# Altium schematic sheet Force.SchDoc: Force
size A4; Author: João Guimarães; Revision: 2.0
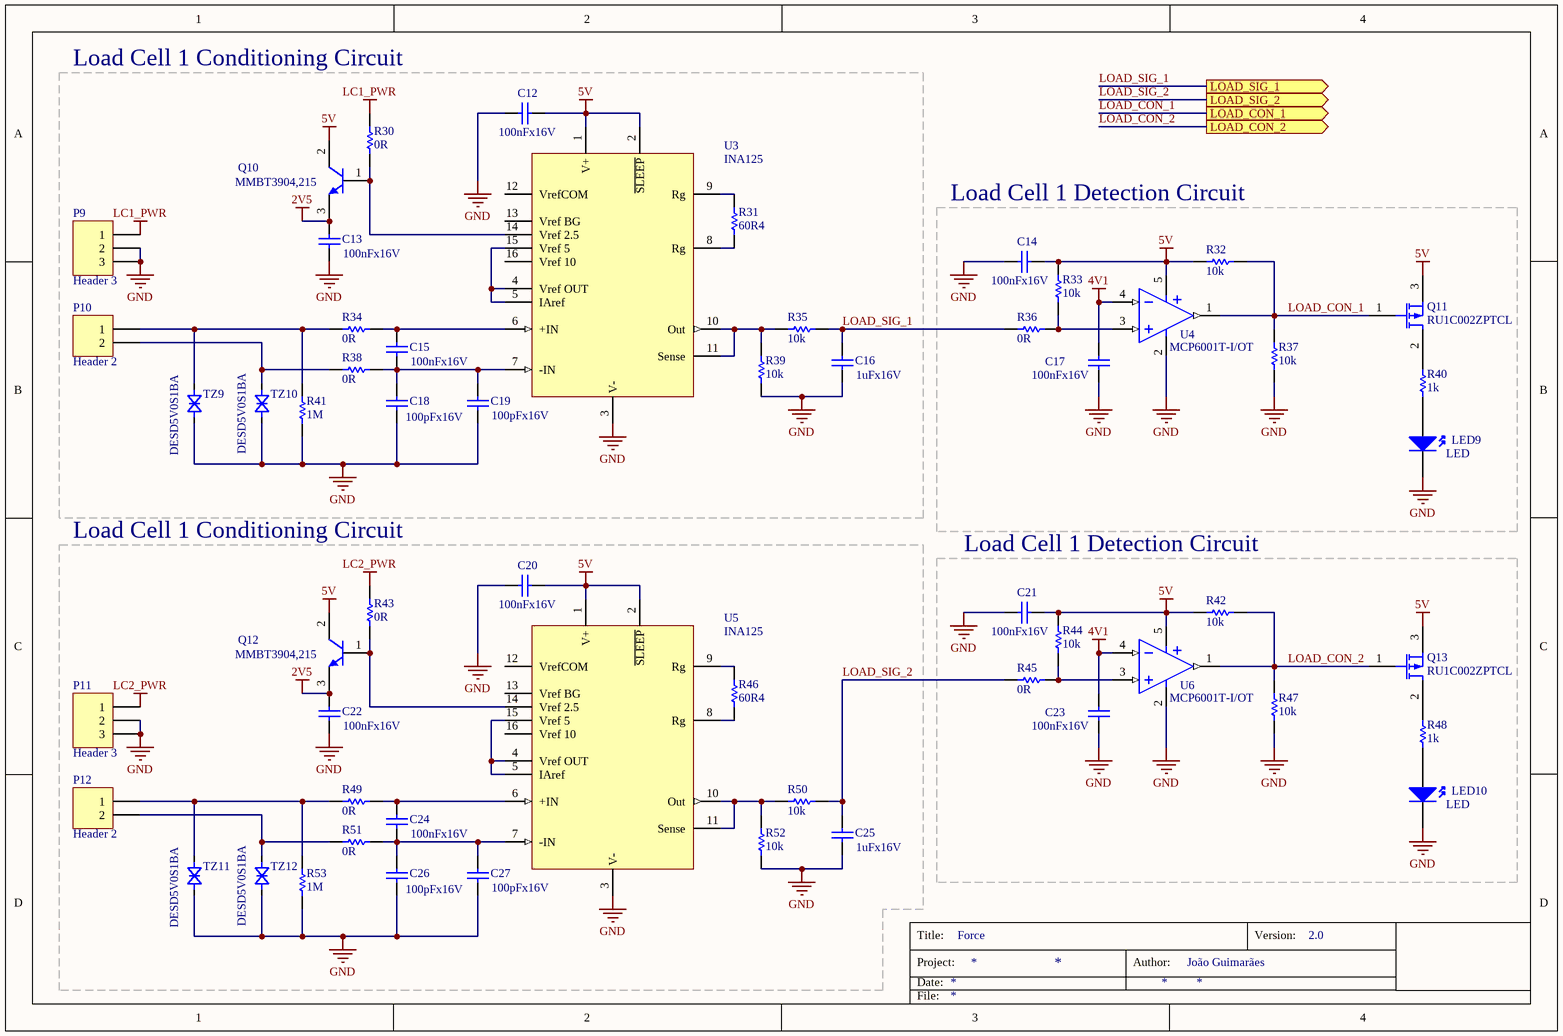
[diagram p0: Force.SchDoc]

## Parts
C12  100nFx16V  [DISC-0805]
C13  100nFx16V  [DISC-0805]
C14  100nFx16V  [DISC-0805]
C15  100nFx16V  [DISC-0805]
C16  1uFx16V  [DISC-0805]
C17  100nFx16V  [DISC-0805]
C18  100pFx16V  [DISC-0805]
C19  100pFx16V  [DISC-0805]
C20  100nFx16V  [DISC-0805]
C21  100nFx16V  [DISC-0805]
C22  100nFx16V  [DISC-0805]
C23  100nFx16V  [DISC-0805]
C24  100nFx16V  [DISC-0805]
C25  1uFx16V  [DISC-0805]
C26  100pFx16V  [DISC-0805]
C27  100pFx16V  [DISC-0805]
LED9  LED  [DISC-LED-0.1-PTH]
LED10  LED  [DISC-LED-0.1-PTH]
P9  Header 3  [CON-FLEXWIRE-0.5MM2-1X3]
P10  Header 2  [CON-BORNE-2]
P11  Header 3  [CON-FLEXWIRE-0.5MM2-1X3]
P12  Header 2  [CON-BORNE-2]
Q10  MMBT3904,215  [DISC-SOT-23]
Q11  RU1C002ZPTCL  [DISC-SOT-23]
Q12  MMBT3904,215  [DISC-SOT-23]
Q13  RU1C002ZPTCL  [DISC-SOT-23]
R30  0R  [DISC-0805]
R31  60R4  [DISC-0805]
R32  10k  [DISC-0805]
R33  10k  [DISC-0805]
R34  0R  [DISC-0805]
R35  10k  [DISC-0805]
R36  0R  [DISC-0805]
R37  10k  [DISC-0805]
R38  0R  [DISC-0805]
R39  10k  [DISC-0805]
R40  1k  [DISC-0805]
R41  1M  [DISC-0805]
R42  10k  [DISC-0805]
R43  0R  [DISC-0805]
R44  10k  [DISC-0805]
R45  0R  [DISC-0805]
R46  60R4  [DISC-0805]
R47  10k  [DISC-0805]
R48  1k  [DISC-0805]
R49  0R  [DISC-0805]
R50  10k  [DISC-0805]
R51  0R  [DISC-0805]
R52  10k  [DISC-0805]
R53  1M  [DISC-0805]
TZ9  DESD5V0S1BA  [DISC-SOD-323]
TZ10  DESD5V0S1BA  [DISC-SOD-323]
TZ11  DESD5V0S1BA  [DISC-SOD-323]
TZ12  DESD5V0S1BA  [DISC-SOD-323]
U3  INA125  [CI-SOIC-16]
U4  MCP6001T-I/OT  [CI-SOT-23-5]
U5  INA125  [CI-SOIC-16]
U6  MCP6001T-I/OT  [CI-SOT-23-5]

## Blocks framed on the sheet
Load Cell 1 Conditioning Circuit: C12 C13 C15 C16 C18 C19 P9 P10 Q10 R30 R31 R34 R35 R38 R39 R41 TZ9 TZ10 U3
Load Cell 1 Detection Circuit: C14 C17 LED9 Q11 R32 R33 R36 R37 R40 U4
Load Cell 1 Conditioning Circuit: C20 C22 C24-C27 P11 P12 Q12 R43 R46 R49-R53 TZ11 TZ12 U5
Load Cell 1 Detection Circuit: C21 C23 LED10 Q13 R42 R44 R45 R47 R48 U6

## Ports
LOAD_CON_1 (out), LOAD_CON_2 (out), LOAD_SIG_1 (out), LOAD_SIG_2 (out)

## Nets
2V5: C13.2 C22.2 Q10.3(E) Q12.3(E)
4V1: C17.2 C23.2 U4.4(IN-) U6.4(IN-)
5V: C12.1 C14.2 C20.1 C21.2 Q10.2(C) Q11.3(S) Q12.2(C) Q13.3(S) R32.1 R33.1 R42.1 R44.1 U3.1(V+) U3.2(~{SLEEP}) U4.5(V+) U5.1(V+) U5.2(~{SLEEP}) U6.5(V+)
GND: C12.2 C13.1 C14.1 C16.1 C17.1 C18.1 C19.1 C20.2 C21.1 C22.1 C23.1 C25.1 C26.1 C27.1 LED9.2(K) LED10.2(K) P9.2 P9.3 P11.2 P11.3 R37.2 R39.2 R41.1 R47.2 R52.2 R53.1 TZ9.1(A) TZ10.1(A) TZ11.1(A) TZ12.1(A) U3.3(V-) U4.2(V-) U5.3(V-) U6.2(V-)
LC1_PWR: P9.1 R30.1
LC2_PWR: P11.1 R43.1
LOAD_CON_1: Q11.1(G) R32.2 R37.1 U4.1(Out) ; port LOAD_CON_1
LOAD_CON_2: Q13.1(G) R42.2 R47.1 U6.1(Out) ; port LOAD_CON_2
LOAD_SIG_1: C16.2 R35.2 R36.1 ; port LOAD_SIG_1
LOAD_SIG_2: C25.2 R45.1 R50.2 ; port LOAD_SIG_2
NetC15_1: C15.1 C18.2 C19.2 R38.1 U3.7(-IN)
NetC15_2: C15.2 R34.1 U3.6(+IN)
NetC24_1: C24.1 C26.2 C27.2 R51.1 U5.7(-IN)
NetC24_2: C24.2 R49.1 U5.6(+IN)
NetLED9_1: LED9.1(A) R40.1
NetLED10_1: LED10.1(A) R48.1
NetP10_1: P10.1 R34.2 R41.2 TZ9.2(K)
NetP10_2: P10.2 R38.2 TZ10.2(K)
NetP12_1: P12.1 R49.2 R53.2 TZ11.2(K)
NetP12_2: P12.2 R51.2 TZ12.2(K)
NetQ10_1: Q10.1(B) R30.2 U3.14(Vref_2.5)
NetQ11_2: Q11.2(D) R40.2
NetQ12_1: Q12.1(B) R43.2 U5.14(Vref_2.5)
NetQ13_2: Q13.2(D) R48.2
NetR31_1: R31.1 U3.9(Rg)
NetR31_2: R31.2 U3.8(Rg)
NetR33_2: R33.2 R36.2 U4.3(IN+)
NetR35_1: R35.1 R39.1 U3.10(Out) U3.11(Sense)
NetR44_2: R44.2 R45.2 U6.3(IN+)
NetR46_1: R46.1 U5.9(Rg)
NetR46_2: R46.2 U5.8(Rg)
NetR50_1: R50.1 R52.1 U5.10(Out) U5.11(Sense)
NetU3_4: U3.4(Vref_OUT) U3.5(IAref) U3.15(Vref_5)
NetU5_4: U5.4(Vref_OUT) U5.5(IAref) U5.15(Vref_5)

Not connected (* = marked no-connect by the designer): U3 12(VrefCOM) 13(Vref_BG) 16(Vref_10); U5 12(VrefCOM) 13(Vref_BG) 16(Vref_10)

## Notes on the sheet
- Title:
- Project:
- Date:
- Author:
- Version:
- File:

## Library data of the parts
C12-C27 = Cap: Capacitor
P9 P11 = Header 3: Header, 3-Pin; LatestRevisionDate: 17-Jul-2002; LatestRevisionNote: Re-released for DXP Platform.; Publisher: Altium Limited
P10 P12 = Header 2: Header, 2-Pin; LatestRevisionDate: 17-Jul-2002; LatestRevisionNote: Re-released for DXP Platform.; Publisher: Altium Limited
Q10 Q12 = Transistor-NPN: NPN Bipolar Transistor; Published: 8-Jun-2000; LatestRevisionDate: 17-Jul-2002; LatestRevisionNote: Re-released for DXP Platform.; PackageReference: TO-226-AA; Publisher: Altium Limited; PackageDescription: TO, Flat Index; 3 In-Line, Axial Leads; Body Dia. 4.8mm; Leads 0.55 x 0.51 mm (max); Code_JEDEC: TO-226-AA
Q11 Q13 = Transistor-PMOS: P-Channel MOSFET
R30-R53 = Res: Resistor
TZ9-TZ12 = TVZ-Bi-Directional
U3 U5 = INA125P: INSTRUMENTATION AMPLIFIER With Precision Voltage Reference
U4 U6 = MCP6001T-I/OT: Operational Amplifiers - Op Amps Single 1.8V 1MHz